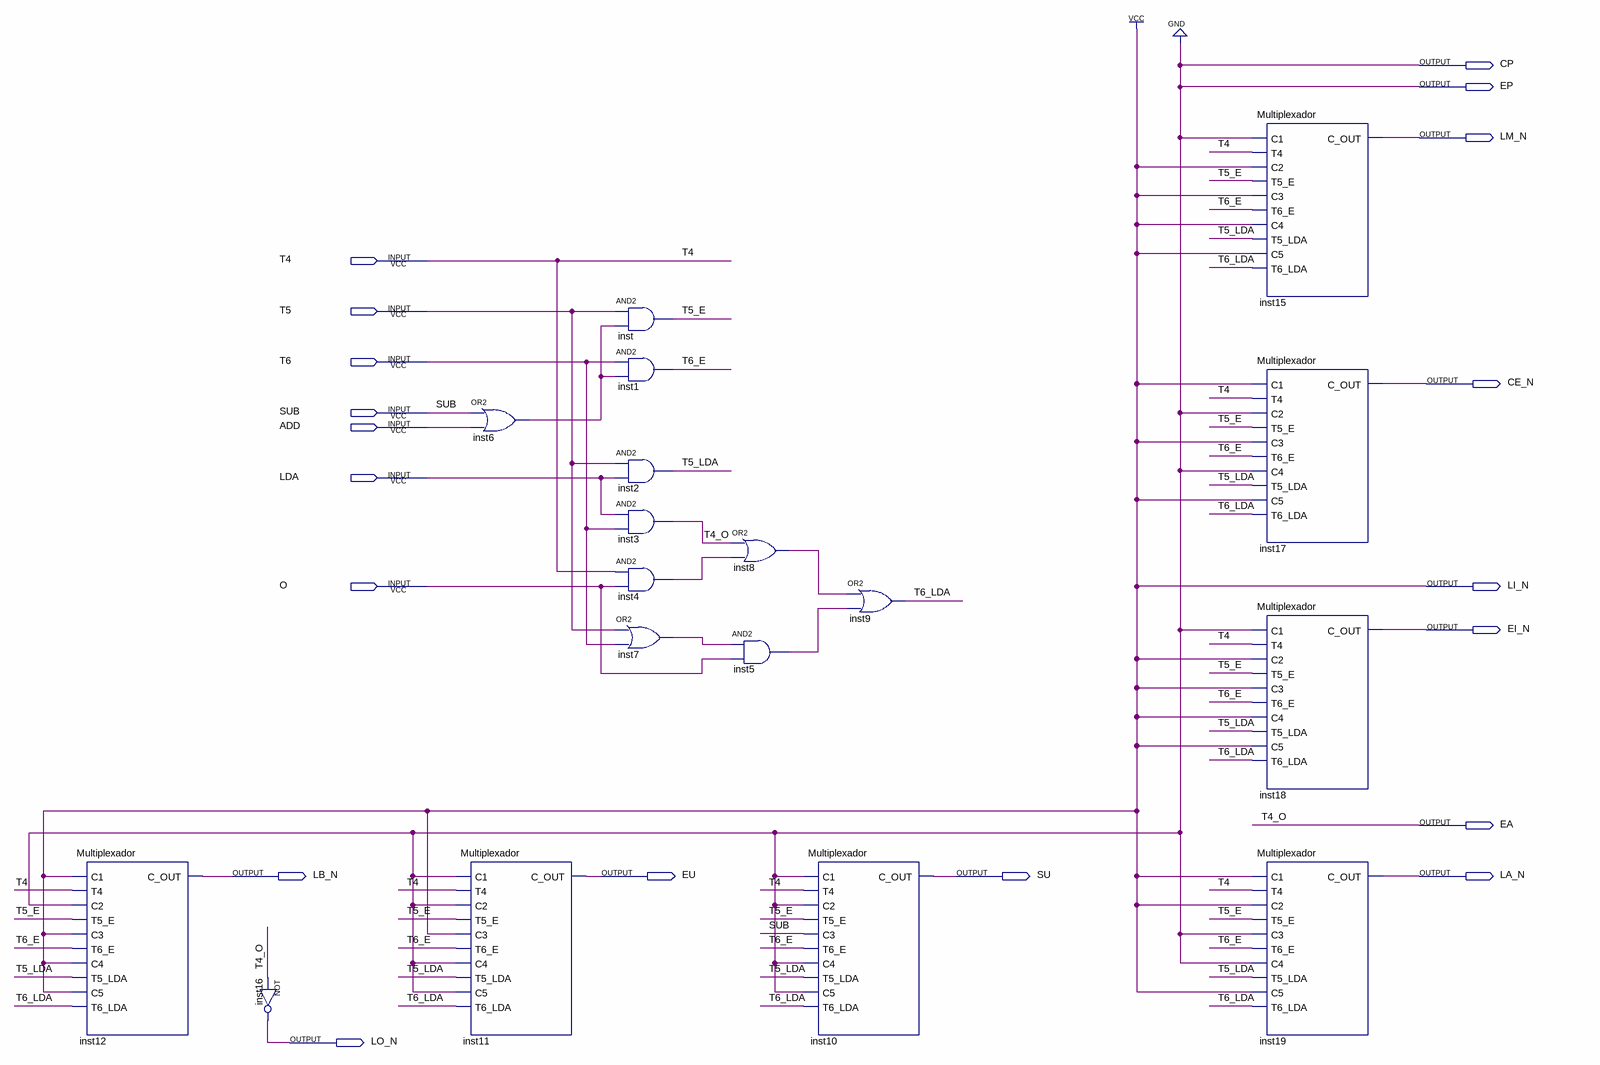
[diagram p0: schematic sheet]
// Quartus schematic Execution.bdf as structural Verilog: 18 symbols, 19 pins
module Execution (
  input  T4,
  input  T5,
  input  T6,
  input  SUB,
  input  ADD,
  input  LDA,
  input  O,
  output CP,
  output EP,
  output LM_N,
  output CE_N,
  output LI_N,
  output EI_N,
  output EA,
  output LB_N,
  output EU,
  output SU,
  output LA_N,
  output LO_N
);

  wire inst4_out, inst5_out, inst6_out, inst7_out, inst8_out, T5_E, T5_LDA, T6_E, T6_LDA;

  Multiplexador inst12 (
    .C1(1'b1), .T4(T4), .C2(1'b0), .T5_E(T5_E), .C3(1'b1), .T6_E(T6_E), .C4(1'b1), .T5_LDA(T5_LDA),
    .C5(1'b1), .T6_LDA(T6_LDA), .C_OUT(LB_N));
  not inst16 (LO_N, EA);
  Multiplexador inst11 (
    .C1(1'b0), .T4(T4), .C2(1'b0), .T5_E(T5_E), .C3(1'b1), .T6_E(T6_E), .C4(1'b0), .T5_LDA(T5_LDA),
    .C5(1'b0), .T6_LDA(T6_LDA), .C_OUT(EU));
  or inst6 (inst6_out, SUB, ADD);
  and inst (T5_E, T5, inst6_out);
  and inst1 (T6_E, T6, inst6_out);
  and inst2 (T5_LDA, T5, LDA);
  and inst3 (EA, LDA, T6);
  and inst4 (inst4_out, T4, O);
  or inst7 (inst7_out, T5, T6);
  or inst8 (inst8_out, EA, inst4_out);
  and inst5 (inst5_out, inst7_out, O);
  Multiplexador inst10 (
    .C1(1'b0), .T4(T4), .C2(1'b0), .T5_E(T5_E), .C3(SUB), .T6_E(T6_E), .C4(1'b0), .T5_LDA(T5_LDA), .C5(1'b0),
    .T6_LDA(T6_LDA), .C_OUT(SU));
  or inst9 (T6_LDA, inst8_out, inst5_out);
  Multiplexador inst15 (
    .C1(1'b0), .T4(T4), .C2(1'b1), .T5_E(T5_E), .C3(1'b1), .T6_E(T6_E), .C4(1'b1), .T5_LDA(T5_LDA),
    .C5(1'b1), .T6_LDA(T6_LDA), .C_OUT(LM_N));
  Multiplexador inst17 (
    .C1(1'b1), .T4(T4), .C2(1'b0), .T5_E(T5_E), .C3(1'b1), .T6_E(T6_E), .C4(1'b0), .T5_LDA(T5_LDA),
    .C5(1'b1), .T6_LDA(T6_LDA), .C_OUT(CE_N));
  Multiplexador inst18 (
    .C1(1'b0), .T4(T4), .C2(1'b1), .T5_E(T5_E), .C3(1'b1), .T6_E(T6_E), .C4(1'b1), .T5_LDA(T5_LDA),
    .C5(1'b1), .T6_LDA(T6_LDA), .C_OUT(EI_N));
  Multiplexador inst19 (
    .C1(1'b1), .T4(T4), .C2(1'b1), .T5_E(T5_E), .C3(1'b0), .T6_E(T6_E), .C4(1'b0), .T5_LDA(T5_LDA),
    .C5(1'b1), .T6_LDA(T6_LDA), .C_OUT(LA_N));

  assign CP = 1'b0;
  assign EP = 1'b0;
  assign LI_N = 1'b1;

  // Other names for the same wires on the sheet: T4_O = EA
endmodule
